# EAGLE design RGB_i2c_v1plusRTC_TH (EAGLE 6.4)
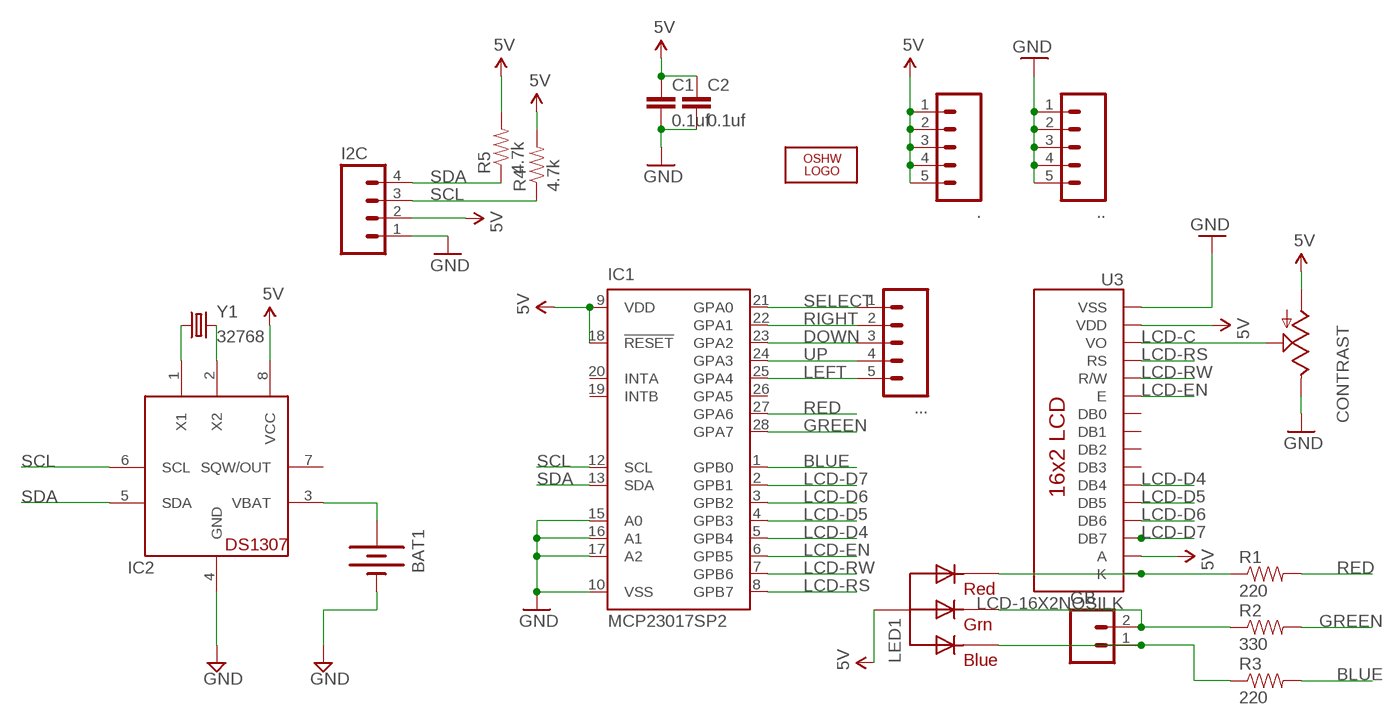
[diagram p0: schematic, sheet 1]

## Parts
.  M05LOCK  [1X05_LOCK]
..  M05LOCK  [1X05_LOCK]
...  M05LOCK  [1X05_LOCK]
BAT1  BATTERY12MM  [BATTCON_12MM]
C1  0.1uf  CAPKIT  [CAP-PTH-SMALL-KIT]
C2  0.1uf  CAPKIT  [CAP-PTH-SMALL-KIT]
CONTRAST  TRIM  [6MM]
GB  M02LOCK  [1X02_LOCK]
I2C  M04LOCK  [1X04_LOCK]
IC1  MCP23017SP2  [DIL28-3-ROUND]
IC2  DS1307  [DIL08]
LED1  RGBLED_CA-5MM  [LED5MMRGB]
LOGO2  OSHW_LOGO_10MILX0350-NT  [OSHW_10X350_NOTEXT]
R1  220  RESISTORAXIAL-0.3  [AXIAL-0.3]
R2  330  RESISTORAXIAL-0.3  [AXIAL-0.3]
R3  220  RESISTORAXIAL-0.3  [AXIAL-0.3]
R4  4.7k  RESISTORAXIAL-0.3  [AXIAL-0.3]
R5  4.7k  RESISTORAXIAL-0.3  [AXIAL-0.3]
U3  LCD-16X2NOSILK  [LCD-16X2_NOSILK]
Y1  32768  CRYSTALTC38H  [TC38H]

## Nets
5V: ..1 ..2 ..3 ..4 ..5 C1.1 C2.1 CONTRAST.A I2C.2 IC1.9(VDD) IC1.18(!RESET) IC2.8(VCC) LED1.2(VCC) R4.P$2 R5.P$2 U3.2(VDD) U3.15(A)
BLUE: IC1.1(GPB0) R3.P$2
DOWN: ....3 IC1.23(GPA2)
GND: ...1 ...2 ...3 ...4 ...5 BAT1.GND(-) C1.2 C2.2 CONTRAST.E I2C.1 IC1.10(VSS) IC1.15(A0) IC1.16(A1) IC1.17(A2) IC2.4(GND) U3.1(VSS)
GREEN: IC1.28(GPA7) R2.P$2
LCD-C: CONTRAST.S U3.3(VO)
LCD-D4: IC1.5(GPB4) U3.11(DB4)
LCD-D5: IC1.4(GPB3) U3.12(DB5)
LCD-D6: IC1.3(GPB2) U3.13(DB6)
LCD-D7: IC1.2(GPB1) U3.14(DB7)
LCD-EN: IC1.6(GPB5) U3.6(E)
LCD-RS: IC1.8(GPB7) U3.4(RS)
LCD-RW: IC1.7(GPB6) U3.5(R/W)
LEFT: ....5 IC1.25(GPA4)
N$1: GB.2 LED1.3(GREEN) R2.P$1
N$2: GB.1 LED1.4(BLUE) R3.P$1
N$3: BAT1.PWR@1(+) IC2.3(VBAT)
N$4: LED1.1(RED) R1.P$1 U3.16(K)
N$5: IC2.1(X1) Y1.1
N$6: IC2.2(X2) Y1.2
RED: IC1.27(GPA6) R1.P$2
RIGHT: ....2 IC1.22(GPA1)
SCL: I2C.3 IC1.12(SCL) IC2.6(SCL) R4.P$1
SDA: I2C.4 IC1.13(SDA) IC2.5(SDA) R5.P$1
SELECT: ....1 IC1.21(GPA0)
UP: ....4 IC1.24(GPA3)
Unconnected: IC1.19(INTB) IC1.20(INTA) IC1.26(GPA5) IC2.7(SQW/OUT) U3.7(DB0) U3.8(DB1) U3.9(DB2) U3.10(DB3)

## Library data of the parts
. .. ... = SparkFun:M05: Header 5 Standard 5-pin 0.1" header. Use with straight break away headers (SKU : PRT-00116), right angle break away headers (PRT-00553), swiss pins (PRT-00743), machine pins (PRT-00117), and female headers (PRT-00115). Molex polarized connector foot print use with SKU : PRT-08230 with associated crimp pins and housings.
BAT1 = SparkFun:BATTERY: Battery Holders Various common sizes : AA, AAA, 20mm coin cell and 12mm coin cell.
C1 C2 = SparkFun:CAP: Capacitor Standard 0603 ceramic capacitor, and 0.1" leaded capacitor.
CONTRAST = adafruit:TRIM
GB = SparkFun:M02: Header 2 Standard 2-pin 0.1" header. Use with straight break away headers (SKU : PRT-00116), right angle break away headers (PRT-00553), swiss pins (PRT-00743), machine pins (PRT-00117), and female headers (PRT-00115). Molex polarized connector foot print use with SKU : PRT-08233 with associated crimp pins and housings.
I2C = SparkFun:M04: Header 4 Standard 4-pin 0.1" header. Use with straight break away headers (SKU : PRT-00116), right angle break away headers (PRT-00553), swiss pins (PRT-00743), machine pins (PRT-00117), and female headers (PRT-00115). Molex polarized connector foot print use with SKU : PRT-08231 with associated crimp pins and housings. 1MM SMD Version SKU: PRT-10208
IC1 = adafruit:MCP23017: http://ww1.microchip.com/downloads/en/DeviceDoc/21952a.pdf Source: http://ww1.microchip.com/downloads/en/DeviceDoc/21952a.pdf
IC2 = adafruit:DS1307: DS1307 Real time clock (RTC) with battery backup ability. Talk to it via i2c
LED1 = adafruit:RGBLED_CA: RGB LED, common-anode 5MM Staggered pins 5mm Piranha package http://www.ladyada.net/library/pcb/eaglelibrary.html
LOGO2 = ohw-logo:OSHW_LOGO_10MIL
R1-R5 = SparkFun:RESISTOR: Resistor Basic schematic elements and footprints for 0603, 1206, and PTH resistors.
U3 = SparkFun:LCD-16X2
Y1 = SparkFun:CRYSTAL: Crystals Various standard crystals. Proven footprints. Spark Fun Electronics SKU : COM-00534

## Board
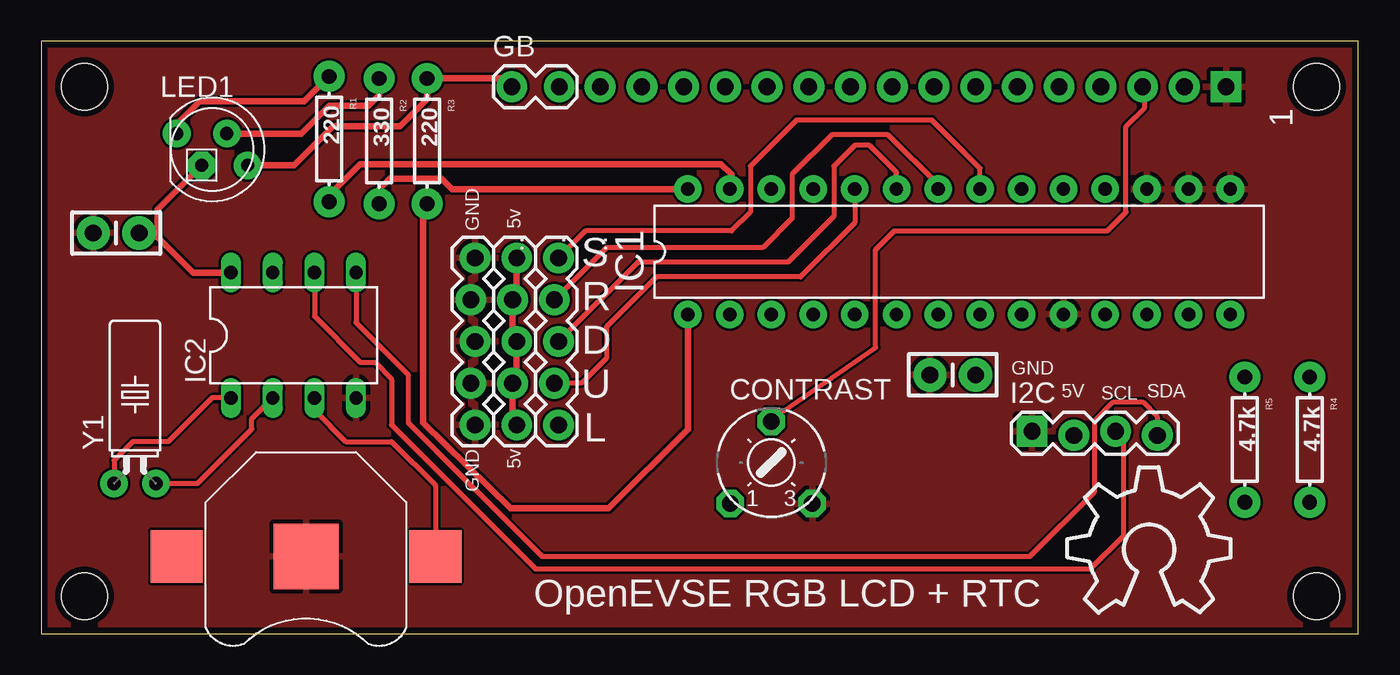
[diagram p1: board, top side]
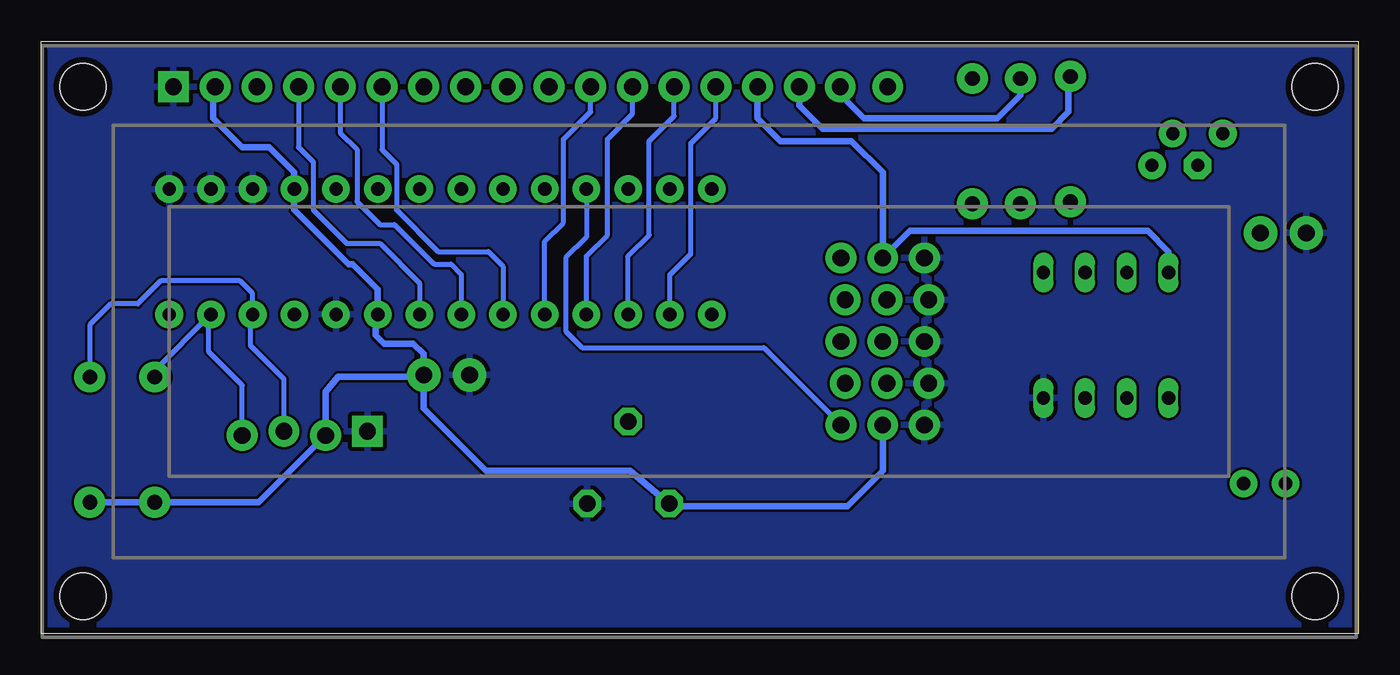
[diagram p2: board, bottom side, seen from below]

Size 80.19 x 36.06 mm. Coordinates in mm from the lower left corner, seen from the top.
Outline: 0,0 80.19,0 80.19,36.06 0,36.06 0,0
Copper layers (1*16): Top 0.0356mm / dielectric 1.5011mm / Bottom 0.0356mm
Design rules "default": minimum track width 6mil, minimum drill 13mil, track to track 6mil, track to pad 6mil, pad to pad 6mil, via to via 6mil, smd to smd 6mil, copper to edge 15mil, drill to drill 6mil, minimum pad ring 7mil, minimum via ring 7mil, stop-mask expansion 4mil, vias tented up to drill 0mil, thermal gap 10mil

### Footprints (pad centres in the part's own frame; a part is rotated, then mirrored left to right if it is on the bottom)
1X05_LOCK = drill 1.016 pad 1.88: 1 0,0.127; 2 2.54,-0.127; 3 5.08,0.127; 4 7.62,-0.127; 5 10.16,0.127
BATTCON_12MM = smd 3.962 x 3.962: GND 0,0 | smd 3.175 x 3.175: PWR@1 -7.874,0; PWR@2 7.874,0
CAP-PTH-SMALL-KIT = drill 1.016 pad 2.032: 1 -1.397,0; 2 1.397,0
6MM = drill 1 pad 1.676 octagon: A -2.5,-2.5; E 2.5,-2.5; S 0,2.5
1X02_LOCK = drill 1.016 pad 1.88: 1 -0.178,0; 2 2.718,0
1X04_LOCK = drill 1.016 pad 1.88 square: 1 0,0.127 | drill 1.016 pad 1.88: 2 2.54,-0.127; 3 5.08,0.127; 4 7.62,-0.127
DIL28-3-ROUND = drill 0.813 pad 1.676: 1 -16.51,-3.81; 2 -13.97,-3.81; 3 -11.43,-3.81; 4 -8.89,-3.81; 5 -6.35,-3.81; 6 -3.81,-3.81; 7 -1.27,-3.81; 8 1.27,-3.81; 9 3.81,-3.81; 10 6.35,-3.81; 11 8.89,-3.81; 12 11.43,-3.81; 13 13.97,-3.81; 14 16.51,-3.81; 15 16.51,3.81; 16 13.97,3.81; 17 11.43,3.81; 18 8.89,3.81; 19 6.35,3.81; 20 3.81,3.81; 21 1.27,3.81; 22 -1.27,3.81; 23 -3.81,3.81; 24 -6.35,3.81; 25 -8.89,3.81; 26 -11.43,3.81; 27 -13.97,3.81; 28 -16.51,3.81
DIL08 = drill 0.813 long: 1 -3.81,-3.81; 2 -1.27,-3.81; 3 1.27,-3.81; 4 3.81,-3.81; 5 3.81,3.81; 6 1.27,3.81; 7 -1.27,3.81; 8 -3.81,3.81
LED5MMRGB = drill 0.8 pad 1.676: 1 -2.159,0.968; 3 0.889,0.968; 4 2.159,-0.968 | drill 0.8 pad 1.676 octagon: 2 -0.635,-0.968
AXIAL-0.3 = drill 0.9 pad 1.88: P$1 -3.81,0; P$2 3.81,0
LCD-16X2_NOSILK = drill 1.016 pad 1.88 square: 1 -32,15.5 | drill 1.016 pad 1.88: 2 -29.46,15.5; 3 -26.92,15.5; 4 -24.38,15.5; 5 -21.84,15.5; 6 -19.3,15.5; 7 -16.76,15.5; 8 -14.22,15.5; 9 -11.68,15.5; 10 -9.14,15.5; 11 -6.6,15.5; 12 -4.06,15.5; 13 -1.52,15.5; 14 1.02,15.5; 15 3.56,15.5; 16 6.1,15.5 | hole 2.8: -37.5,15.5; -37.5,-15.5; 37.5,15.5; 37.5,-15.5
TC38H = drill 0.813 pad 1.676: 1 -1.27,0; 2 1.27,0

### Placement (x,y rotation side)
.  28.83,22.86 270 top
..  26.29,22.86 270 top
...  31.37,22.86 270 top
BAT1  16.13,4.7 180 top
C1  4.57,24.38 180 top
C2  55.5,15.75 180 top
CONTRAST  44.45,10.41 0 top
GB  28.83,33.27 0 top
I2C  60.33,12.19 0 top
IC1  55.88,23.24 0 top
IC2  15.37,18.16 0 top
LED1  10.41,29.46 0 top
LOGO2  62.48,1.27 0 top
R1  17.53,30.1 270 top
R2  20.57,29.97 270 top
R3  23.5,29.97 270 top
R4  77.22,11.81 270 top
R5  73.28,11.81 270 top
U3  40.13,17.78 0 bottom
Y1  5.71,9.14 0 top

### Tracks (layer width: path | path; a pad name or v marks a point on that pad's centre or on a via)
5V
  Top 0.406: 28.83,12.57 ..5 28.7,12.95 ..4 28.96,15.49 ..3 28.7,18.03 ..2 28.96,20.57 ..1 | C1.1 7.11,24.13 | 7.11,24.13 9.27,21.97 IC2.8 | 7.11,24.13 7.11,25.83 LED1.2
  Bottom 0.406: R4.P$2 R5.P$2 66.93,8 I2C.2 62.87,14.73 62.1,15.62 57.15,15.62 C2.1 | C2.1 56.9,17.02 57.53,17.65 59.31,17.65 59.82,18.16 59.82,19.3 IC1.9 59.69,20.95 61.21,22.48 61.47,22.48 64.77,25.78 IC1.18 64.77,28.07 66.29,29.59 67.94,29.59 69.72,31.37 69.72,33.15 U3.2 | C2.1 56.9,13.72 53.09,9.91 44.32,9.91 CONTRAST.A 41.15,7.75 31.11,7.75 28.96,9.91 ..5 | U3.15 36.58,31.37 35.18,29.97 30.86,29.97 28.96,28.07 ..1 27.3,24.51 12.83,24.51 11.56,23.24 IC2.8
BLUE
  Top 0.406: IC1.1 39.37,12.45 34.54,7.62 28.57,7.62 23.24,12.83 23.24,25.91 R3.P$2
DOWN
  Top 0.305: IC1.23 52.07,28.07 50.42,29.72 49.53,29.72 48.26,28.45 48.26,25.4 45.47,22.61 36.32,22.61 ....3
GND
  pour Top: -8.64,-13.97 94.23,-13.97 94.23,53.34 -8.64,53.34
  pour Bottom: -6.35,-5.84 85.85,-4.45 85.85,45.34 -6.35,43.94
GREEN
  Top 0.406: IC1.28 25.02,27.05 24.38,27.69 21.21,27.69 20.45,26.92 20.45,26.29 R2.P$2
LCD-C
  Top 0.305: CONTRAST.S 44.7,13.21 50.8,17.4 50.8,23.37 51.94,24.51 64.9,24.51 66.04,25.65 66.04,30.86 67.18,32 67.18,33.15 U3.3
LCD-D4
  Bottom 0.305: IC1.5 49.53,23.88 48.39,25.02 48.39,30.1 46.74,31.75 U3.11
LCD-D5
  Bottom 0.305: IC1.4 46.99,22.99 45.72,24.26 45.72,30.1 44.2,31.62 U3.12
LCD-D6
  Bottom 0.305: IC1.3 44.45,22.99 43.18,24.26 43.18,29.97 41.66,31.5 U3.13
LCD-D7
  Bottom 0.305: IC1.2 41.91,21.84 40.64,23.11 40.64,29.84 39.12,31.37 U3.14
LCD-EN
  Bottom 0.305: U3.6 59.43,29.46 58.55,28.57 58.55,25.78 56.01,23.24 52.96,23.24 52.07,22.35 IC1.6
LCD-RS
  Bottom 0.305: U3.4 64.51,29.59 63.63,28.7 63.63,25.78 61.59,23.75 59.56,23.75 57.15,21.34 IC1.8
LCD-RW
  Bottom 0.305: U3.5 61.97,30.48 60.96,29.46 60.96,26.29 59.56,24.89 58.67,24.89 56.26,22.48 55.24,22.48 54.61,21.84 IC1.7
LEFT
  Bottom 0.305: IC1.25 46.99,24.13 48.26,22.86 48.26,18.41 47.24,17.4 36.2,17.4 ....5
N$1
  Top 0.406: LED1.3 15.83,30.43 17.53,32.13 19.94,32.13 20.57,32.77 R2.P$1
  Bottom 0.406: GB.2 31.55,32.82 30.1,31.37 21.97,31.37 20.57,32.77 R2.P$1
N$2
  Top 0.406: LED1.4 15.41,28.5 17.78,30.86 21.84,30.86 23.5,32.51 R3.P$1 28.14,33.78 GB.1
N$3
  Top 0.305: IC2.3 16.64,13.59 18.54,11.68 21.34,11.68 24,9.02 BAT1.PWR@1 24.38,4.32
N$4
  Top 0.406: LED1.1 8.26,30.99 9.65,32.38 16,32.38 R1.P$1
  Bottom 0.406: U3.16 34.03,32.13 32.64,30.73 18.67,30.73 17.65,31.75 17.65,33.78 R1.P$1
N$5
  Top 0.305: IC2.1 10.41,14.35 7.75,11.68 5.59,11.68 4.45,10.54 Y1.1
N$6
  Top 0.305: Y1.2 9.53,9.14 12.83,12.45 12.83,13.08 IC2.2
RED
  Top 0.406: R1.P$2 17.53,26.67 19.43,28.57 41.4,28.57 42.04,27.94 42.04,27.18 IC1.27
RIGHT
  Top 0.305: IC1.22 54.61,27.3 51.56,30.35 48.13,30.35 45.72,27.94 45.72,25.27 43.94,23.5 34.42,23.5 ....2
SCL
  Top 0.305: IC2.6 16.64,19.3 19.43,16.51 20.32,16.51 21.34,15.49 21.34,12.7 30.1,3.94 63.88,3.94 65.91,5.97 65.91,11.81 I2C.3
  Bottom 0.305: I2C.3 65.41,15.49 67.44,17.53 67.44,19.3 IC1.12 67.31,20.7 68.07,21.46 72.9,21.46 74.3,20.07 75.95,20.07 77.22,18.8 R4.P$1 77.22,14.99
SDA
  Top 0.305: IC2.5 19.18,18.92 22.35,15.75 22.35,12.83 30.48,4.7 60.2,4.7 64.14,8.64 64.14,12.95 65.28,14.1 67.06,14.1 67.94,13.21 I2C.4
  Bottom 0.305: I2C.4 67.94,15.11 69.98,17.14 69.98,19.3 IC1.13 73.28,16 R5.P$1
SELECT
  Top 0.305: IC1.21 57.15,28.32 54.23,31.24 45.97,31.24 43.18,28.45 43.18,25.65 42.04,24.51 33.15,24.51 ....1
UP
  Top 0.305: IC1.24 49.53,25.02 46.23,21.72 37.47,21.72 34.42,18.67 34.42,16.76 32.89,15.24 ....4

### Text on the board
tNames: 1 | GND | 5v | S | R | D | GND | U | 5V | SCL | SDA | L | 5v | GND | OpenEVSE RGB LCD + RTC